# Altium schematic sheet SP2_BUCKs_GPU_LOG_CPU-B.SchDoc
size A3; Date: 07.08.2025; CheckedBy: Own Check; CompanyName: No Company; DocumentNumber: ELK.PCB.0005.0005.A.A; Revision: V0.0.1; SheetNumber: 21; SheetTotal: 22
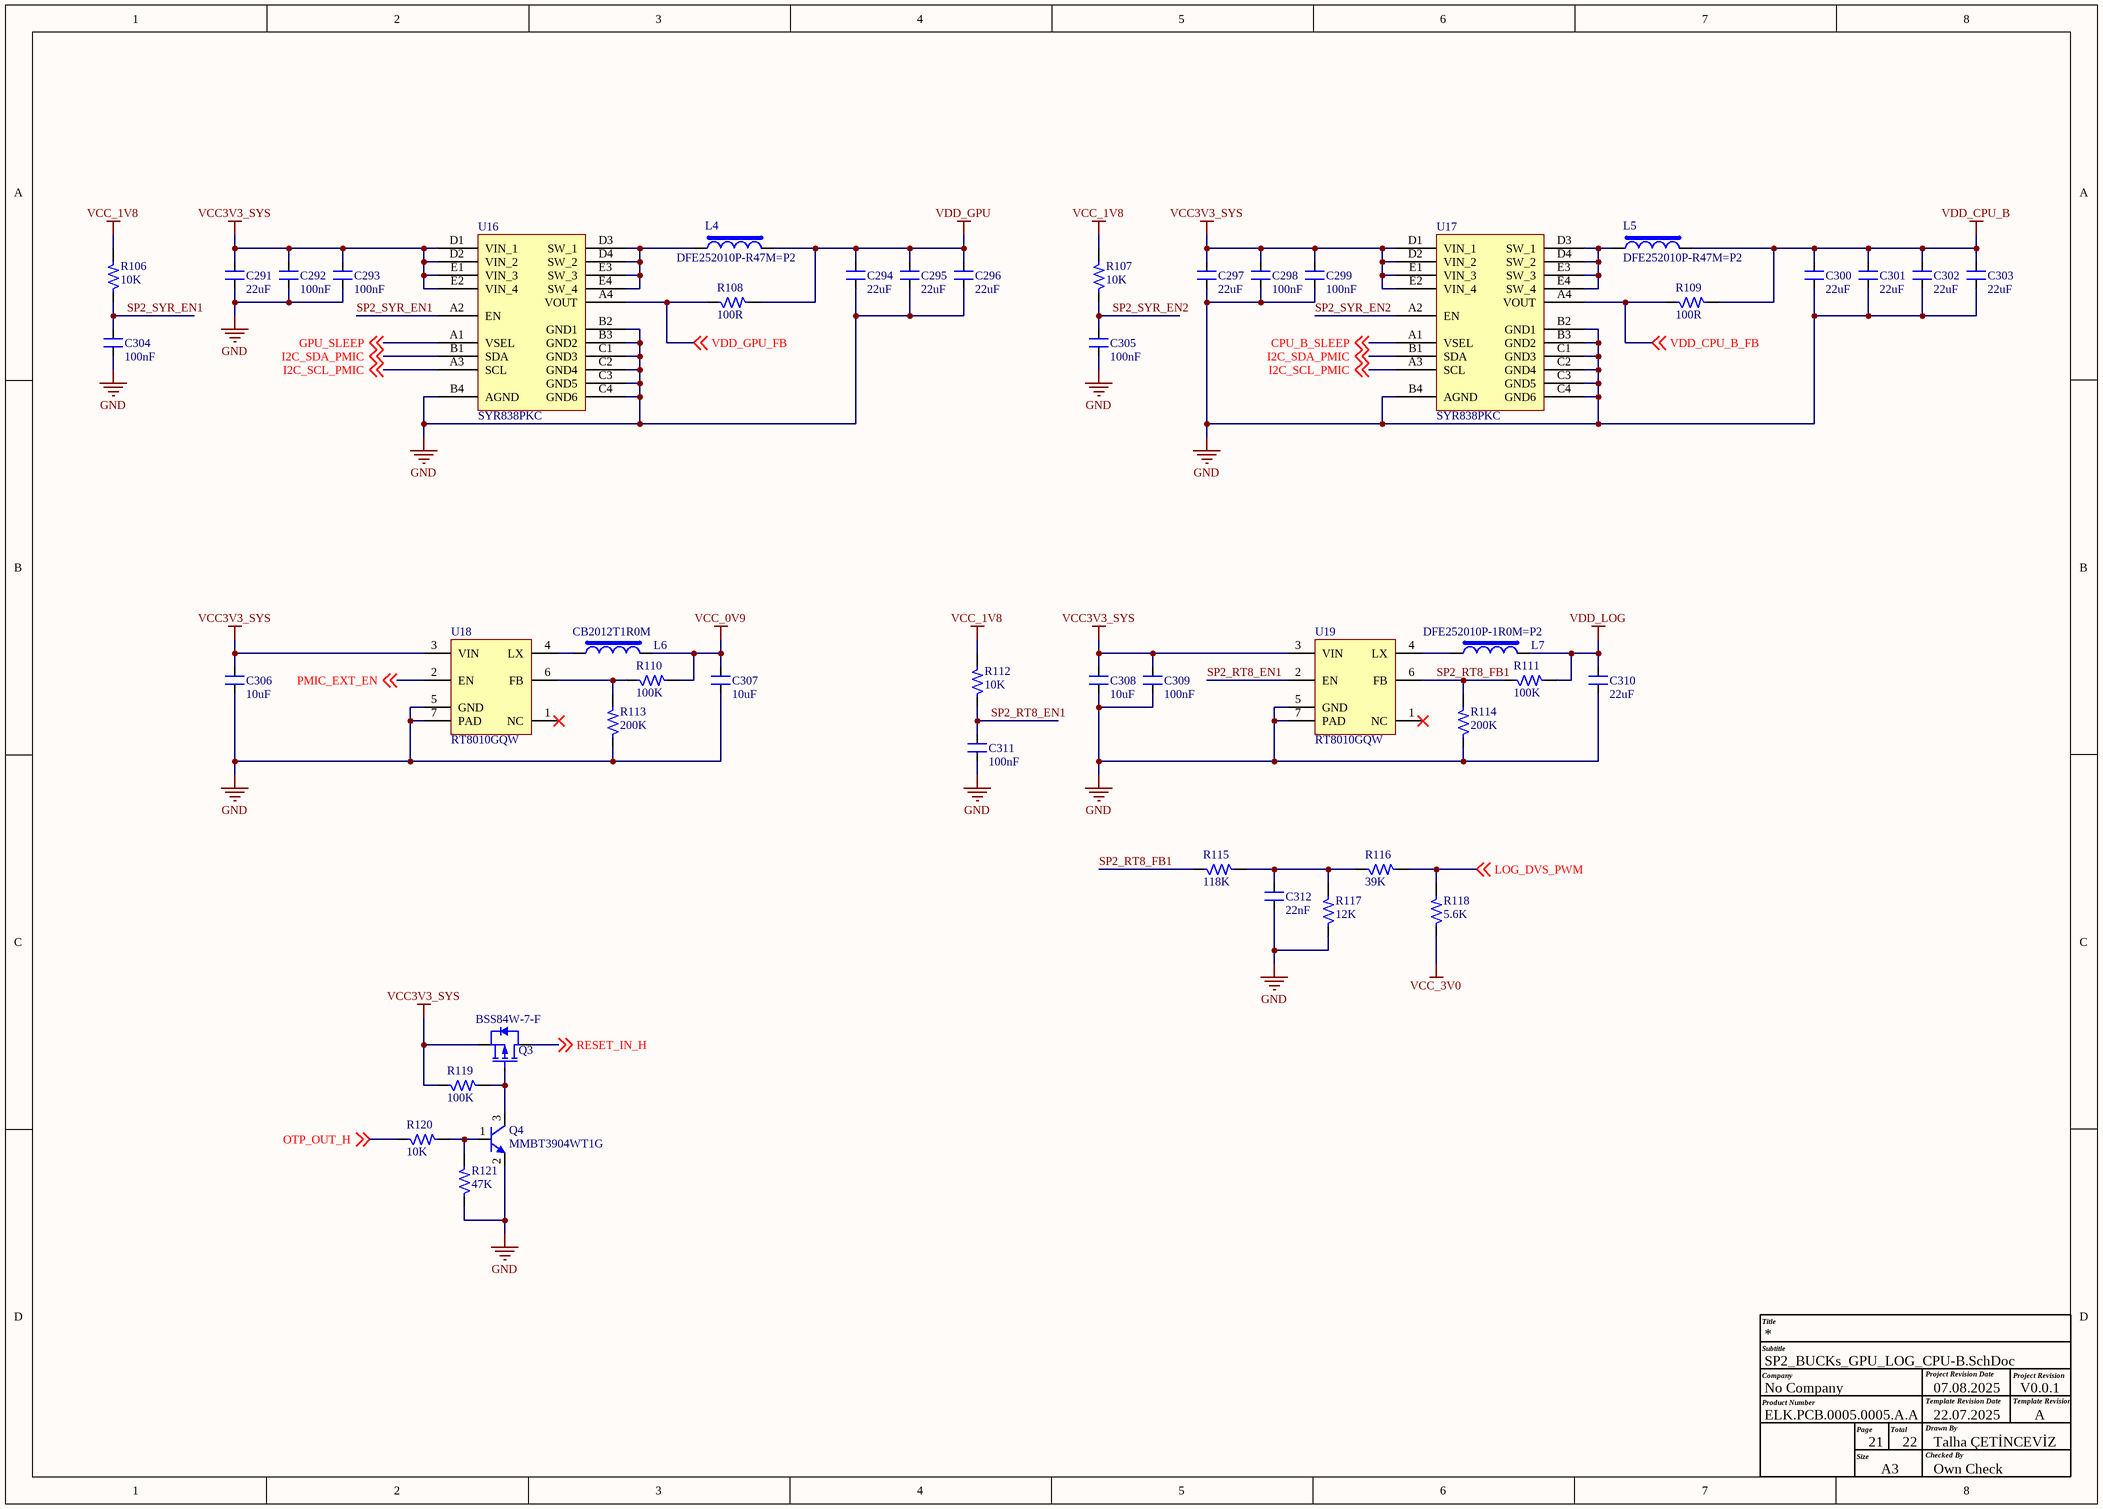
[diagram p0: SP2_BUCKs_GPU_LOG_CPU-B.SchDoc]

## Parts
C291  22uF  [CAP_0603]
C292  100nF  [CAP_0402]
C293  100nF  [CAP_0402]
C294  22uF  [CAP_0603]
C295  22uF  [CAP_0603]
C296  22uF  [CAP_0603]
C297  22uF  [CAP_0603]
C298  100nF  [CAP_0402]
C299  100nF  [CAP_0402]
C300  22uF  [CAP_0603]
C301  22uF  [CAP_0603]
C302  22uF  [CAP_0603]
C303  22uF  [CAP_0603]
C304  100nF  [CAP_0402]
C305  100nF  [CAP_0402]
C306  10uF  [CAP_0402]
C307  10uF  [CAP_0402]
C308  10uF  [CAP_0402]
C309  100nF  [CAP_0402]
C310  22uF  [CAP_0603]
C311  100nF  [CAP_0402]
C312  22nF  [CAP_0402]
L4  DFE252010P-R47M=P2  [IND_1008]
L5  DFE252010P-R47M=P2  [IND_1008]
L6  CB2012T1R0M  [IND_0805]
L7  DFE252010P-1R0M=P2  [IND_1008]
Q3  BSS84W-7-F  [SOT-323-3]
Q4  MMBT3904WT1G  [SOT-323-3]
R106  10K  [RES_0402]
R107  10K  [RES_0402]
R108  100R  [RES_0402]
R109  100R  [RES_0402]
R110  100K  [RES_0402]
R111  100K  [RES_0402]
R112  10K  [RES_0402]
R113  200K  [RES_0402]
R114  200K  [RES_0402]
R115  118K  [RES_0402]
R116  39K  [RES_0402]
R117  12K  [RES_0402]
R118  5.6K  [RES_0402]
R119  100K  [RES_0402]
R120  10K  [RES_0402]
R121  47K  [RES_0402]
U16  SYR838PKC  [CSP20_15.7_100x84_SMD]
U17  SYR838PKC  [CSP20_15.7_100x84_SMD]
U18  RT8010GQW  [WDFN-6_26_133X100_SMD]
U19  RT8010GQW  [WDFN-6_26_133X100_SMD]

## Nets
GND: C291.1 C292.1 C293.1 C294.1 C295.1 C296.1 C297.1 C298.1 C299.1 C300.1 C301.1 C302.1 C303.1 C304.1 C305.1 C306.1 C307.1 C308.1 C309.1 C310.1 C311.1 C312.1 Q4.2(E) R113.1 R114.1 R117.1 R121.1 U16.B2(GND1) U16.B3(GND2) U16.B4(AGND) U16.C1(GND3) U16.C2(GND4) U16.C3(GND5) U16.C4(GND6) U17.B2(GND1) U17.B3(GND2) U17.B4(AGND) U17.C1(GND3) U17.C2(GND4) U17.C3(GND5) U17.C4(GND6) U18.5(GND) U18.7(PAD) U19.5(GND) U19.7(PAD)
VCC3V3_SYS: C291.2 C292.2 C293.2 C297.2 C298.2 C299.2 C306.2 C308.2 C309.2 Q3.2(S) R119.1 U16.D1(VIN_1) U16.D2(VIN_2) U16.E1(VIN_3) U16.E2(VIN_4) U17.D1(VIN_1) U17.D2(VIN_2) U17.E1(VIN_3) U17.E2(VIN_4) U18.3(VIN) U19.3(VIN)
VCC_0V9: C307.2 L6.2 R110.2
VCC_1V8: R106.2 R107.2 R112.2
VCC_3V0: R118.1
VDD_CPU_B: C300.2 C301.2 C302.2 C303.2 L5.2 R109.2
VDD_GPU: C294.2 C295.2 C296.2 L4.2 R108.2
VDD_LOG: C310.2 L7.2 R111.2
CPU_B_SLEEP: U17.A1(VSEL) ; off-sheet CPU_B_SLEEP
GPU_SLEEP: U16.A1(VSEL) ; off-sheet GPU_SLEEP
I2C_SCL_PMIC: U16.A3(SCL) U17.A3(SCL) ; off-sheet I2C_SCL_PMIC
I2C_SDA_PMIC: U16.B1(SDA) U17.B1(SDA) ; off-sheet I2C_SDA_PMIC
LOG_DVS_PWM: R116.2 R118.2 ; off-sheet LOG_DVS_PWM
OTP_OUT_H: R120.1 ; off-sheet OTP_OUT_H
PMIC_EXT_EN: U18.2(EN) ; off-sheet PMIC_EXT_EN
RESET_IN_H: Q3.3(D) ; off-sheet RESET_IN_H
SP2_RT8_EN1: C311.2 R112.1 U19.2(EN)
SP2_RT8_FB1: R111.1 R114.2 R115.1 U19.6(FB)
SP2_SYR_EN1: C304.2 R106.1 U16.A2(EN)
SP2_SYR_EN2: C305.2 R107.1 U17.A2(EN)
VDD_CPU_B_FB: R109.1 U17.A4(VOUT) ; off-sheet VDD_CPU_B_FB
VDD_GPU_FB: R108.1 U16.A4(VOUT) ; off-sheet VDD_GPU_FB
NetC312_2: C312.2 R115.2 R116.1 R117.2
NetL4_1: L4.1 U16.D3(SW_1) U16.D4(SW_2) U16.E3(SW_3) U16.E4(SW_4)
NetL5_1: L5.1 U17.D3(SW_1) U17.D4(SW_2) U17.E3(SW_3) U17.E4(SW_4)
NetL6_1: L6.1 U18.4(LX)
NetL7_1: L7.1 U19.4(LX)
NetQ3_1: Q3.1(G) Q4.3(C) R119.2
NetQ4_1: Q4.1(B) R120.2 R121.2
NetR110_1: R110.1 R113.2 U18.6(FB)

Not connected (* = marked no-connect by the designer): U18 1(NC)*; U19 1(NC)*

## Notes on the sheet
- Title
- Company
- Product Number
- Subtitle
- Project Revision Date
- Template Revision Date
- Project Revision
- Template Revision
- Size
- Page
- A3
- Total
- Checked By
- Drawn By
- 22.07.2025
- Talha ÇETİNCEVİZ
- A

## Library data of the parts
C291 C294-C297 C300-C303 C310 = CAP_22uF-10V-20%-0603: 22µF ±20% 10V Ceramic Capacitor X5R 0603 (1608 Metric); Manufacturer: Murata Electronics; Manufacturer Part Number: GRM188R61A226ME15D; Case/Package: 0603; Supplier-1: Digikey
C292 C293 C298 C299 C304 C305 C309 C311 = CAP_100nF-25V-10%-0402: 0.1µF ±10% 25V Ceramic Capacitor X7R 0402 (1005 Metric); Manufacturer: Walsin Technology Corporation; Manufacturer Part Number: 0402B104K250CT; Case/Package: 0402; Supplier-1: Digikey
C306-C308 = CAP_10uF-10V-20%-0402: 10µF ±20% 10V Ceramic Capacitor X5R 0402 (1005 Metric); Manufacturer Part Number: CL05A106MP5NUNC; Manufacturer: Samsung Electro-Mechanics; Case/Package: 0402; Supplier-1: Digikey
C312 = CAP_22nF-10V-10%-0402: 0.022µF ±10% 10V Ceramic Capacitor X7R 0402 (1005 Metric); Manufacturer: Samsung Electro-Mechanics; Manufacturer Part Number: CL05B223KP5NNNC; Case/Package: 0402; Supplier-1: Digikey
L4 L5 = IND_470nH-5A-20%-1008: 470nH Shielded Wirewound Inductor 5A 35mOhm Max 1008 (2520 Metric); Manufacturer: Murata Electronics; Manufacturer Part Number: DFE252010P-R47M=P2; Case/Package: 1008; Supplier-1: Digikey
L6 = IND_1uF-0.5A-20%-0805: 1uH ±20% 500mA 150mΩ 0805 Inductors (SMD) RoHS; Manufacturer: Taiyo Yuden; Manufacturer Part Number: CB2012T1R0M; Case/Package: 0805; Supplier-1: LCSC
L7 = IND_1uH-3.8A-20%-1008: 1µH Shielded Wirewound Inductor 3.8A 54mOhm Max 1008 (2520 Metric); Manufacturer: Murata Electronics; Manufacturer Part Number: DFE252010P-1R0M=P2; Case/Package: 1008; Supplier-1: Digikey
Q3 = MOSFET-P_50V-130mA-SOT-323: P-Channel 50V 130mA (Ta) 200mW (Ta) Surface Mount SOT-323; Manufacturer: Diodes Incorporated; Manufacturer Part Number: BSS84W-7-F; Case/Package: SOT-323; Supplier-1: Digikey
Q4 = TRNS-NPN_60V-0.2A-SOT323: Bipolar Transistors - BJT 200mA 60V NPN; Manufacturer: ON Semiconductor; Manufacturer Part Number: MMBT3904WT1G; Case/Package: SOT323; Supplier-1: Digikey
R106 R107 R112 R120 = RES_10K-0.1W-1%-0402: 10 kOhms ±1% 0.1W, 1/10W Chip Resistor 0402 (1005 Metric) Anti-Sulfur Thin Film; Manufacturer: Vishay Beyschlag/Draloric/BC Components; Manufacturer Part Number: MCS04020C1002FE000; Case/Package: 0402; Supplier-1: Digikey
R108 R109 = RES_100R-0.1W-1%-0402: 100 Ohms ±1% 0.1W, 1/10W Chip Resistor 0402 (1005 Metric) Automotive AEC-Q200, Moisture Resistant Thick Film; Manufacturer: KOA Speer Electronics, Inc.; Manufacturer Part Number: RK73H1ETTP1000F; Case/Package: 0402; Supplier-1: Digikey
R110 R111 R119 = RES_100K-0.1W-1%-0402: 100 kOhms ±1% 0.1W, 1/10W Chip Resistor 0402 (1005 Metric) Anti-Sulfur Thin Film; Manufacturer: Vishay Beyschlag/Draloric/BC Components; Manufacturer Part Number: MCS04020C1003FE000; Case/Package: 0402; Supplier-1: Digikey
R113 R114 = RES_200K-0.1W-1%-0402: 200 kOhms ±1% 0.1W, 1/10W Chip Resistor 0402 (1005 Metric) Automotive AEC-Q200 Thick Film; Manufacturer: Panasonic Electronic Components; Manufacturer Part number: ERJ-2RKF2003X; Case/Package: 0402; Supplier-1: Digikey
R115 = RES_118K-0.1W-1%-0402: 118 kOhms ±1% 0.1W, 1/10W Chip Resistor 0402 (1005 Metric) Automotive AEC-Q200, Moisture Resistant Thick Film; Manufacturer: KOA Speer Electronics, Inc.; Manuafcturer Part Number: RK73H1ETTP1183F; Case/Package: 0402; Supplier-1: Digikey
R116 = RES_39K-0.1W-1%-0402: 39 kOhms ±1% 0.1W, 1/10W Chip Resistor 0402 (1005 Metric) Automotive AEC-Q200, Moisture Resistant Thick Film; Manufacturer: KOA Speer Electronics, Inc.; Manufacturer Part Number: RK73H1ETTP3902F; Case/Package: 0402; Supplier-1: Digikey
R117 = RES_12K-0.1W-1%-0402: 12 kOhms ±1% 0.1W, 1/10W Chip Resistor 0402 (1005 Metric) Anti-Sulfur Thin Film; Manufacturer: Vishay Beyschlag/Draloric/BC Components; Manufacturer Part Number: MCS04020C1202FE000; Case/Package: 0402; Supplier-1: Digikey
R118 = RES_5.6K-0.1W-1%-0402: 5.6 kOhms ±1% 0.1W, 1/10W Chip Resistor 0402 (1005 Metric) Automotive AEC-Q200, Moisture Resistant Thick Film; Manufacturer: KOA Speer Electronics, Inc.; Manufacturer Part Number: RK73H1ETTP5601F; Case/Package: 0402; Supplier-1: Digikey
R121 = RES_47K-0.1W-1%-0402: 47 kOhms ±1% 0.1W, 1/10W Chip Resistor 0402 (1005 Metric) Automotive AEC-Q200 Thick Film; Manufacturer: Panasonic Electronic Components; Manufacturer Part Number: ERJ-2RKF4702X; Case/Package: 0402; Supplier-1: Digikey
U16 U17 = IC_SYR838PKC: Step-Down Positive Programmable 1 6A 2.4MHz CSP1.56*1.96-20 DC-DC Converters RoHS; Manufacturer: Silergy Corp; Manufacturer Part Number: SYR838PKC; Case/Package: CSP1.56*1.96-20; Supplier-1: LCSC
U18 U19 = REG-ADJ_5.5V-5.5V-1A-6-WDFN: Buck Switching Regulator IC Positive Adjustable 0.6V 1 Output 1A 6-WDFN Exposed Pad; Manufacturer: Richtek USA Inc.; Manufacturer Part Number: RT8010GQW; Case/Package: 6-WDFN; Supplier-1: Digikey